# Altium schematic sheet HBridgeInterface.SchDoc
size A4; SheetNumber: 2; SheetTotal: 2
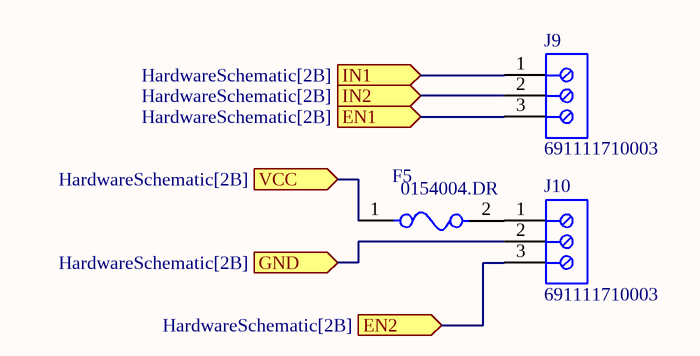
[diagram p0: HBridgeInterface.SchDoc]

## Parts
F5  0154004.DR  [FP-0154-MFG]
J9  691111710003  [691111710003]
J10  691111710003  [691111710003]

## Ports
EN1 (in, see HardwareSchematic[2B]), EN2 (in, see HardwareSchematic[2B]), GND (in, see HardwareSchematic[2B]), IN1 (in, see HardwareSchematic[2B]), IN2 (in, see HardwareSchematic[2B]), VCC (in, see HardwareSchematic[2B])

## Nets
EN1: J9.3 ; port EN1
EN2: J10.3 ; port EN2
GND: J10.2 ; port GND
IN1: J9.1 ; port IN1
IN2: J9.2 ; port IN2
VCC: F5.1 ; port VCC
NetF5_2: F5.2 J10.1

## Library data of the parts
F5 = CMP-08605-000003-1: FUSE BRD MNT 4A 125VAC/VDC 2SMD; Manufacturer: Littelfuse; Fuse Blow Speed: Fast; Max Fuse Ac Voltage: 125V; Lead Free: Yes; Device Class L3: unset; Manufacturer Part Number: 0154004.DR; Device Class L2: Fuses; Package: 0154; ComponentLink2Description: Datasheet; Temperature Range Low: -55°C; Temperature Range High: +125°C; Device Class L1: Circuit Protection; Height: 3.81mm; Temperature: -55°C to +125°C; Mouser Description: Surface Mount Fuses Fuseblock w/ fuse 4A OMNI BLOK 154; Automotive: No; Digikey Description: FUSE BRD MNT 4A 125VAC/VDC 2SMD; RoHS: TRUE; Category: Fuse; Fuse Current: 4A; Max Fuse Dc Voltage: 125V; ComponentLink2URL: https://www.littelfuse.com/~/media/electronics/datasheets/fuses/littelfuse_fuse_154_154t_154l_154tl_datasheet.pdf.pdf; Octopart: https://octopart.com/0154004.dr-littelfuse-565861
J9 J10 = CMP-1502-03263-2: NexarPartId: 8917709; Wire/Cable Gauge: 26AWG; Wire Gauge (Min): 14AWG; Plating: Steel; Pitch: 5.0038mm; Current: 8A; Number of Positions Per Level: 3; Number of Levels: 1; Voltage Rating: 300V; Stripping Length: -6mm; Length: 7.6mm; Lead Pitch: 5mm; Color: Green; Termination: Screw; Wire Gauge (Max): 26AWG; Max Operating Temperature: 105°C; RoHS: Compliant; Width: 16.2mm; REACH SVHC: Unknown; Current Rating: 8A; Packaging: Box; Contact Material: Brass; Contact Plating: Tin; Number of Contacts: 3; Voltage: 300V; Height: 14mm; Number of Pins: 3; Mount: Through Hole; Min Operating Temperature: -40°C; Housing Material: Nylon